# EAGLE design osccc (EAGLE 9.6.2)
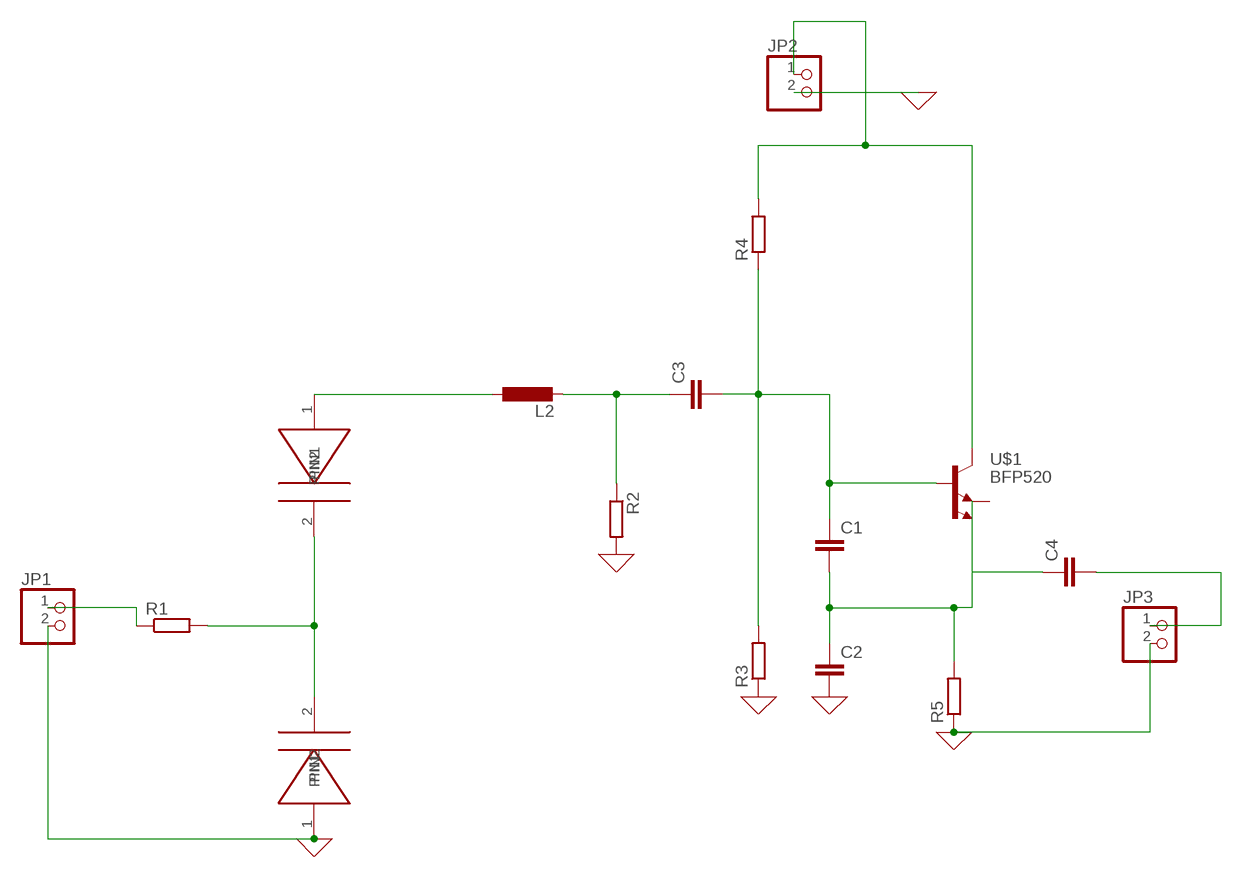
[diagram p0: schematic, sheet 1]

## Parts
C1  C-EUC0603  [C0603]
C2  C-EUC0603  [C0603]
C3  C-EUC0603  [C0603]
C4  C-EUC0603  [C0603]
JP1  PINHD-1X2  [1X02]
JP2  PINHD-1X2  [1X02]
JP3  PINHD-1X2  [1X02]
L2  L-EUL0603  [L0603]
R1  R-EU_R0603  [R0603]
R2  R-EU_R0603  [R0603]
R3  R-EU_R0603  [R0603]
R4  R-EU_R0603  [R0603]
R5  R-EU_R0603  [R0603]
U$1  BFP520  [SOT343]
U$2  BBY5702  [BBY5702]
U$3  BBY5702  [BBY5702]

## Nets
0: C2.2 JP1.2 JP2.2 JP3.2 R2.2 R3.1 R5.1 U$2.1(PIN1) ; supply symbol labelled GND
N$1: R1.2 U$2.2(PIN2) U$3.2(PIN2)
N$2: L2.1 U$3.1(PIN1)
N$3: C3.1 L2.2 R2.1
N$4: C1.1 C3.2 R3.2 R4.1 U$1.1(B)
N$5: C1.2 C2.1 C4.1 R5.2 U$1.2(E1) U$1.4(E2)
N$6: JP2.1 R4.2 U$1.3(C)
N$7: JP1.1 R1.1
N$8: C4.2 JP3.1

## Library data of the parts
C1-C4 = rcl-2:C-EU: CAPACITOR, European symbol
JP1-JP3 = pinhead:PINHD-1X2: PIN HEADER
L2 = rcl-2:L-EU: INDUCTOR, European symbol
R1-R5 = rcl:R-EU_: RESISTOR, European symbol; SPICEPREFIX: R
U$1 = BFP520:BFP520: Check availability <https://pricing.snapeda.com/parts/BFP520/Infineon%20Technologies/view-part?ref=eda>; AVAILABILITY: In Stock; CHECK_PRICES: https://www.snapeda.com/parts/BFP520/Infineon+Technologies/view-part/?ref=eda; DESCRIPTION: RF Transistor NPN 3.5V 40mA 45GHz 100mW Surface Mount PG-SOT343-4; MF: Infineon Technologies; MP: BFP520; PACKAGE: SOT-343 Infineon; PRICE: None; SNAPEDA_LINK: https://www.snapeda.com/parts/BFP520/Infineon+Technologies/view-part/?ref=snap
U$2 U$3 = BBY5702:BBY5702

## Board
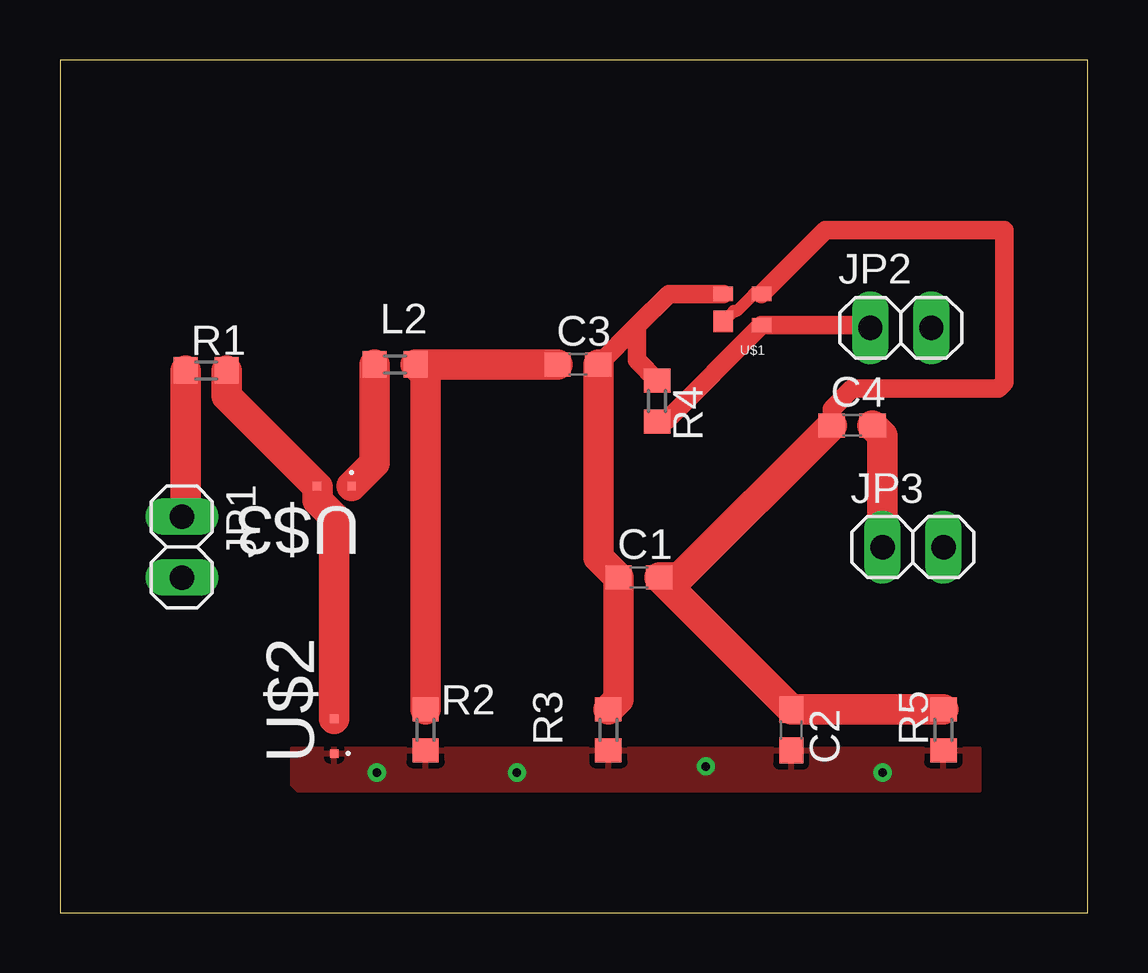
[diagram p1: board, top side]
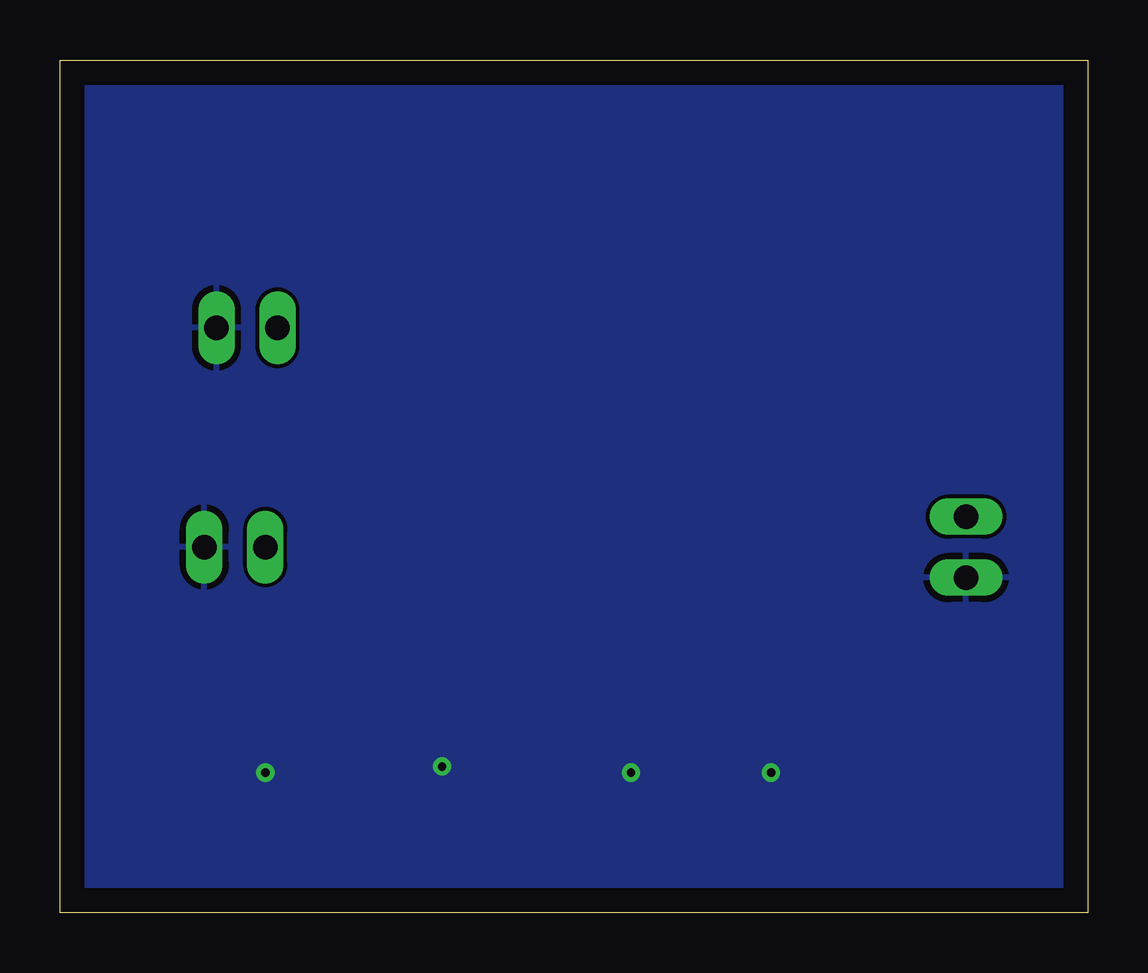
[diagram p2: board, bottom side, seen from below]

Size 42.85 x 35.55 mm. Coordinates in mm from the lower left corner, seen from the top.
Outline: 0,0 42.85,0 42.85,35.55 0,35.55 0,0
Copper layers (1*16): Top 0.035mm / dielectric 1.5mm / Bottom 0.035mm
Design rules "default": minimum track width 6mil, minimum drill 0.35mm, track to track 6mil, track to pad 6mil, pad to pad 6mil, via to via 6mil, smd to smd 6mil, copper to edge 40mil, drill to drill 6mil, minimum pad ring 10mil, minimum via ring 8mil, stop-mask expansion 4mil, vias tented up to drill 0mil, thermal gap 10mil

### Footprints (pad centres in the part's own frame; a part is rotated, then mirrored left to right if it is on the bottom)
C0603 = smd 1.1 x 1: 1 -0.85,0; 2 0.85,0
1X02 = drill 1.016 long: 1 -1.27,0; 2 1.27,0
L0603 = smd 1 x 1.1: 1 -0.85,0; 2 0.85,0
R0603 = smd 1 x 1.1: 1 -0.85,0; 2 0.85,0
SOT343 = smd 0.6 x 0.8: 1 -0.65,-0.8; 3 0.65,0.8; 4 -0.65,0.8 | smd 0.9 x 0.8: 2 0.5,-0.8
BBY5702 = smd 0.35 x 0.35: 1 -0.725,0; 2 0.725,0

### Placement (x,y rotation side)
C1  24.13,13.97 0 top
C2  30.48,7.62 270 top
C3  21.59,22.86 0 top
C4  33.02,20.32 0 top
JP1  5.08,15.24 270 top
JP2  35.05,24.38 0 top
JP3  35.56,15.24 0 top
L2  13.97,22.86 0 top
R1  6.1,22.61 0 top
R2  15.24,7.62 270 top
R3  22.86,7.62 90 top
R4  24.89,21.34 270 top
R5  36.83,7.62 90 top
U$1  28.45,25.15 270 top
U$2  11.43,7.37 90 top
U$3  11.43,17.78 180 top

### Tracks (layer width: path | path; a pad name or v marks a point on that pad's centre or on a via)
0  (via drill 0.35)
  other vias: 13.21,5.84 34.29,5.84 19.05,5.84 26.92,6.1
  pour Bottom: 0,35.56 0,0 43.18,0 43.18,35.56
  pour Top: 15.75,6.86 38.35,6.86 38.35,5.08 9.91,5.08 9.65,5.33 9.65,6.86
N$1
  Top 1.27: R1.2 6.95,21.54 U$3.2 10.73,17.75 10.73,17.19 11.43,16.49 U$2.2
N$2
  Top 1.27: U$3.1 13.12,18.75 L2.1
N$3
  Top 1.27: R2.1 15.24,22.44 L2.2 C3.1
N$4
  Top 0.762: C3.2 24.05,24.47 | 24.05,24.47 25.38,25.8 U$1.1 | R4.1 24.05,23.03 24.05,24.47
  Top 1.27: C3.2 22.44,14.81 C1.1 23.28,8.89 R3.2
N$5
  Top 0.508: U$1.2 28.09,25.09 28.22,25.09 28.92,25.8 U$1.4
  Top 0.762: U$1.4 31.9,28.45 39.37,28.45 39.37,22.1 39.12,21.84 33.02,21.84 32.17,20.99 C4.1
  Top 1.27: R5.2 C2.1 C1.2 25.82,13.97 C4.1
N$6
  Top 0.762: JP2.1 33.67,24.5 U$1.3 25.24,20.49 R4.2
N$7
  Top 1.27: R1.1 5.25,16.68 JP1.1
N$8
  Top 1.27: C4.2 34.29,19.9 JP3.1